# Altium schematic sheet СФ МЭИ ЛБ ПЭ2-18 11.03.04 02 Э3.SchDoc
size 420 x 297 mm; Scale: 1:1; Разраб.: Гончаренко А.Ю.; Пров.: Смолин В.А.; Номер листа: 1; Общее количество листов: 1; Наименование изделия 1: Промежуточный усилитель; Наименование изделия 2: Схема электрическая; Наименование изделия 3: принципиальная; Нач. отд.: Нач. отд.; Децимальный номер: СФ МЭИ ЛБ ПЭ2-18 11.03.04 02 Э3; Наименование. Строка 2: Промежуточный усилитель; Наименование. Строка 3: Схема электирическая принципиальная; Наименование. Строка 1: Мощный; Разработал: Гончаренко А.Ю.; Проверил: Смолин В.А.; Утвердил: Рассказа Д.С.; Литера: У; Масштаб: 1:1; Лист. Номер: 1; Лист. Всего: 1
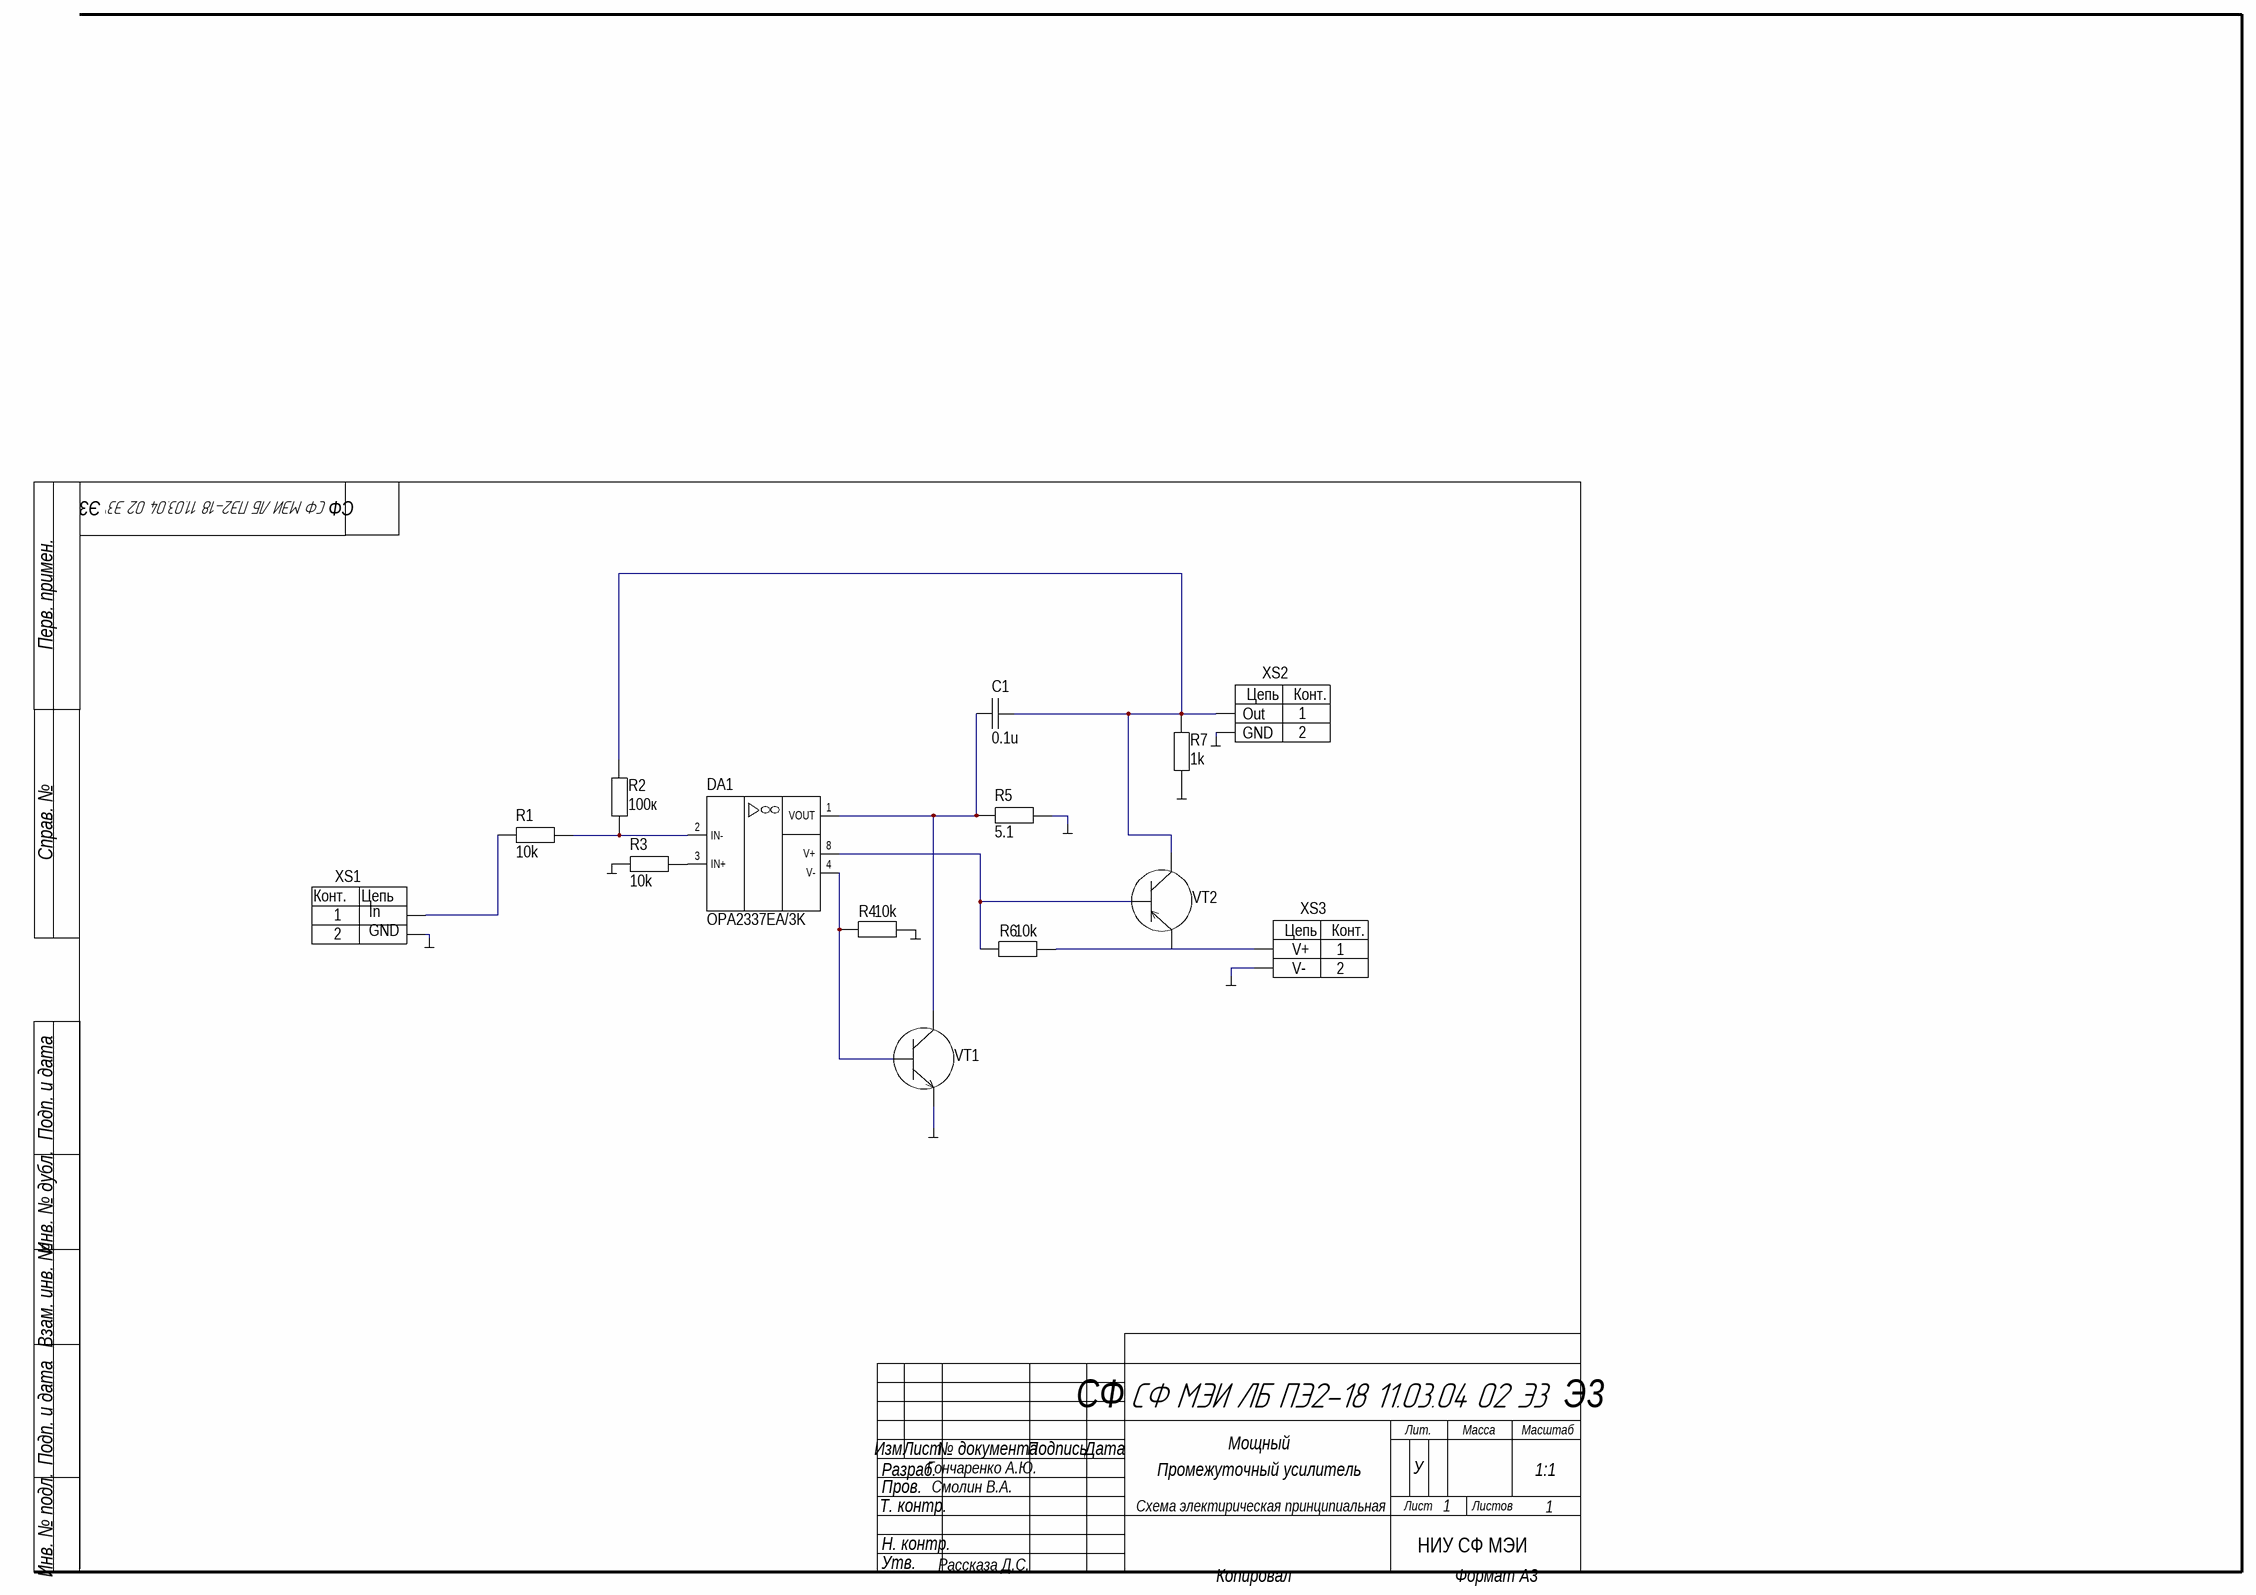
[diagram p0: СФ МЭИ ЛБ ПЭ2-18 11.03.04 02 Э3.SchDoc]

## Parts
C1  0.1u  [0805]
DA1  OPA2337EA/3K  [SOIC-8]
R1  10k  [0805]
R2  100к  [0805]
R3  10k  [0805]
R4  10k  [0805]
R5  5.1  [0805]
R6  10k  [0805]
R7  1k  [0805]
VT1  Биполярный транзистор n-p-n  [SOT23]  (value not drawn)
VT2  Биполярный транзистор p-n-p  [SOT23]  (value not drawn)
XS1  SM02B  [CI1102M1H  (F)]  (value not drawn)
XS2  SM02B  [CI1102M1H  (F)]  (value not drawn)
XS3  SM02B  [CI1102M1H  (F)]  (value not drawn)

## Nets
NetR3_1: R3.1 R4.2 R5.2 R7.1 VT1.3(K) XS1.2(Pin2) XS2.2(Pin2) XS3.2(Pin2)
NetC1_1: C1.1 DA1.1(VOUT) R5.1 VT1.2(E)
NetC1_2: C1.2 R2.2 R7.2 VT2.2(E) XS2.1(Pin1)
NetDA1_2: DA1.2(IN-) R1.2 R2.1
NetDA1_3: DA1.3(IN+) R3.2
NetDA1_4: DA1.4(V-) R4.1 VT1.1(B)
NetDA1_8: DA1.8(V+) R6.1 VT2.1(B)
NetR1_1: R1.1 XS1.1(Pin1)
NetR6_2: R6.2 XS3.1(Pin1)

Not connected (* = marked no-connect by the designer): VT2 3(K)

## Notes on the sheet
- (near XS2) Out
- (near XS2) GND
- (near XS1) In
- (near XS1) GND
- (near XS3) V-
- (near XS3) V+
- НИУ СФ МЭИ ПЭ2-18
- Перв. примен.
- Справ. №
- Подп. и дата
- Инв. № дубл.
- Взам. инв. №
- Разраб.
- Изм.
- Лист
- № документа
- Подпись
- Дата
- Лит.
- Масса
- Масштаб
- Т. контр.
- Пров.
- Листов
- Инв. № подл.
- Н. контр.
- Утв.
- Копировал
- Формат A3
- (in symbol SM02B) Цепь; Конт.

## Library data of the parts
C1 = К53-68"R"-25В-0.1 мкФ ±10% 0805_1: К53-68"R"-25В-0.1 мкФ ±10%
R1 R3 R4 R6 = 0.125Вт 0805 10 кОм, 5%, Чип резистор (SMD): 0805-0.125 Вт -10 кОм±5%
R2 = 0.125Вт 0805 100к кОм, 5%, Чип резистор (SMD)_1: 0805-0.125 Вт -100 кОм±5%
R5 = 0.125Вт 0805 5.1 кОм, 5%, Чип резистор (SMD): 0805-0.125 Вт -5.1 кОм±5%
R7 = 0.125Вт 0805 1 кОм, 5%, Чип резистор (SMD): 0805-0.125 Вт -1 кОм±5%
VT1 = 2N697
VT2 = 2N2338